# Altium schematic sheet Digital_In.SchDoc
size A
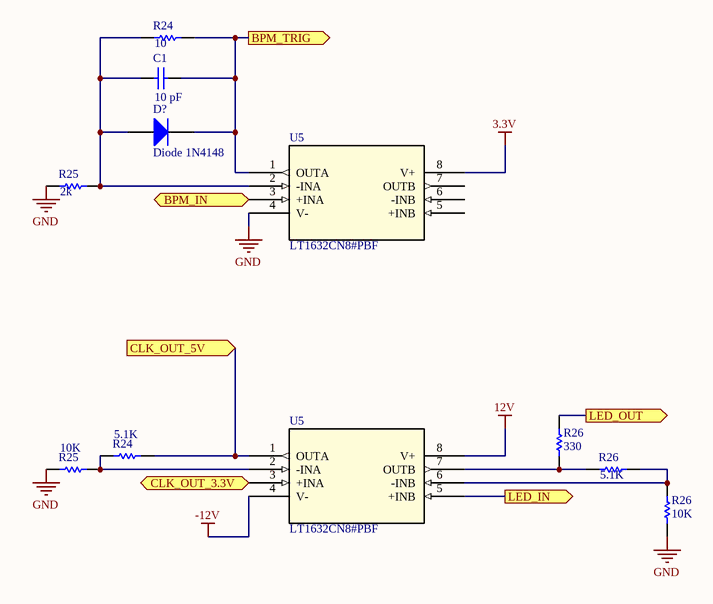
[diagram p0: Digital_In.SchDoc]

## Parts
(Parts that share a designator on the sheet are numbered #1, #2 ... from top to bottom, then left to right.)
C1  value 10 pF  [C0805]
D?  Diode 1N4148  [DO-35]
R24#1  value 10  [AXIAL-0.3]  (hidden comment: Res1)
R24#2  value 5.1K  [AXIAL-0.3]  (hidden comment: Res1)
R25#1  value 2k  [AXIAL-0.3]  (hidden comment: Res1)
R25#2  value 10K  [AXIAL-0.3]  (hidden comment: Res1)
R26#1  value 330  [AXIAL-0.3]  (hidden comment: Res1)
R26#2  value 5.1K  [AXIAL-0.3]  (hidden comment: Res1)
R26#3  value 10K  [AXIAL-0.3]  (hidden comment: Res1)
U5#1  LT1632CN8#PBF  [PDIP-8_N]
U5#2  LT1632CN8#PBF  [PDIP-8_N]

## Ports
BPM_IN (in), BPM_TRIG (out), CLK_OUT_3.3V (in), CLK_OUT_5V (in), LED_IN (out), LED_OUT (out)

## Nets
3.3V: U5#1.8(V+)
12V: U5#2.8(V+)
-12V: U5#2.4(V-)
GND: R25#1.1 R25#2.1 R26#3.1 U5#1.4(V-)
BPM_IN: U5#1.3(+INA) ; port BPM_IN
BPM_TRIG: C1.1 D?.2(K) R24#1.2 U5#1.1(OUTA) ; port BPM_TRIG
CLK_OUT_3.3V: U5#2.3(+INA) ; port CLK_OUT_3.3V
CLK_OUT_5V: R24#2.2 U5#2.1(OUTA) ; port CLK_OUT_5V
LED_IN: U5#2.5(+INB) ; port LED_IN
LED_OUT: R26#1.2 ; port LED_OUT
NetC1_2: C1.2 D?.1(A) R24#1.1 R25#1.2 U5#1.2(-INA)
NetR24#2_1: R24#2.1 R25#2.2 U5#2.2(-INA)
NetR26#1_1: R26#1.1 R26#2.1 U5#2.7(OUTB)
NetR26#2_2: R26#2.2 R26#3.2 U5#2.6(-INB)

Not connected (* = marked no-connect by the designer): U5#1 5(+INB) 6(-INB) 7(OUTB)

## Library data of the parts
C1 = Cap: Capacitor; Published: 8-Jun-2000; LatestRevisionDate: 17-Jul-2002; LatestRevisionNote: Re-released for DXP Platform.; PackageReference: RAD-0.3; Publisher: Altium Limited; PackageDescription: Radial Cap, Thru-Hole; 2 Leads; 0.3 in Pin Spacing
D? = Diode 1N4148: High Conductance Fast Diode; Published: 8-Jun-2000; LatestRevisionDate: 17-Jul-2002; LatestRevisionNote: Re-released for DXP Platform.; DatasheetVersion: 1997; PackageReference: DO-35; Publisher: Altium Limited; PackageDescription: Diode, Axial; Body 3.8 x 1.9 mm (LxDia. max), Lead Dia. 0.53 mm (max); Code_JEDEC: DO-204-AH; ComponentLink1Description: Manufacturer Link; ComponentLink1URL: http://www.fairchildsemi.com/; ComponentLink2Description: Datasheet; ComponentLink2URL: http://www.fairchildsemi.com/ds/1N%2F1N4148.pdf
R24#1 R24#2 R25#1 R25#2 R26#1-R26#3 = Res1: Resistor; Published: 8-Jun-2000; LatestRevisionDate: 17-Jul-2002; LatestRevisionNote: Re-released for DXP Platform.; PackageReference: AXIAL-0.3; Publisher: Altium Limited; PackageDescription: Axial Device, Thru-Hole; 2 Leads; 0.3 in Pin Spacing
U5#1 U5#2 = LT1632CN8#PBF: Imported; Operating_Temperature: 0Â°C ~ 70Â°C; Current_-_Output_/_Channel: 70mA; Voltage_-_Input_Offset: 500ÂµV; Current_-_Input_Bias: 1.15ÂµA; Output_Type: Rail-to-Rail; Vendor: Linear Technology; Amplifier_Type: General Purpose; Number_of_Circuits: 2; Slew_Rate: 45 V/Âµs; Gain_Bandwidth_Product: 45MHz; Current_-_Supply: 4.6mA; Current_-_Output/Channel: 40mA; Voltage_-_Supply,_Single/Dual_(Â±): 2.7 V ~ 36 V, Â±1.35 V ~ 18 V; Mounting_Type: Through Hole; 3D_Library_Name: Maxim2; C: Copyright (C) 2016 Accelerated Designs. All rights reserved; -3db_Bandwidth: -; Series: *; Manufacturer_Part_Number: LT1632CN8#PBF; DigiKeyPartNumber: LT1632CN8-ND; Quantity_Available: 0; DataSheet: http://www.linear.com/docs/3055; Packaging: Tube; Package_/_Case: 8-DIP (0.300", 7.62mm); Copyright: Copyright (C) 2015 Accelerated Designs. All rights reserved; Supplier_Device_Package: 8-PDIP; Value: Value; Type: Type; RefDes: RefDes